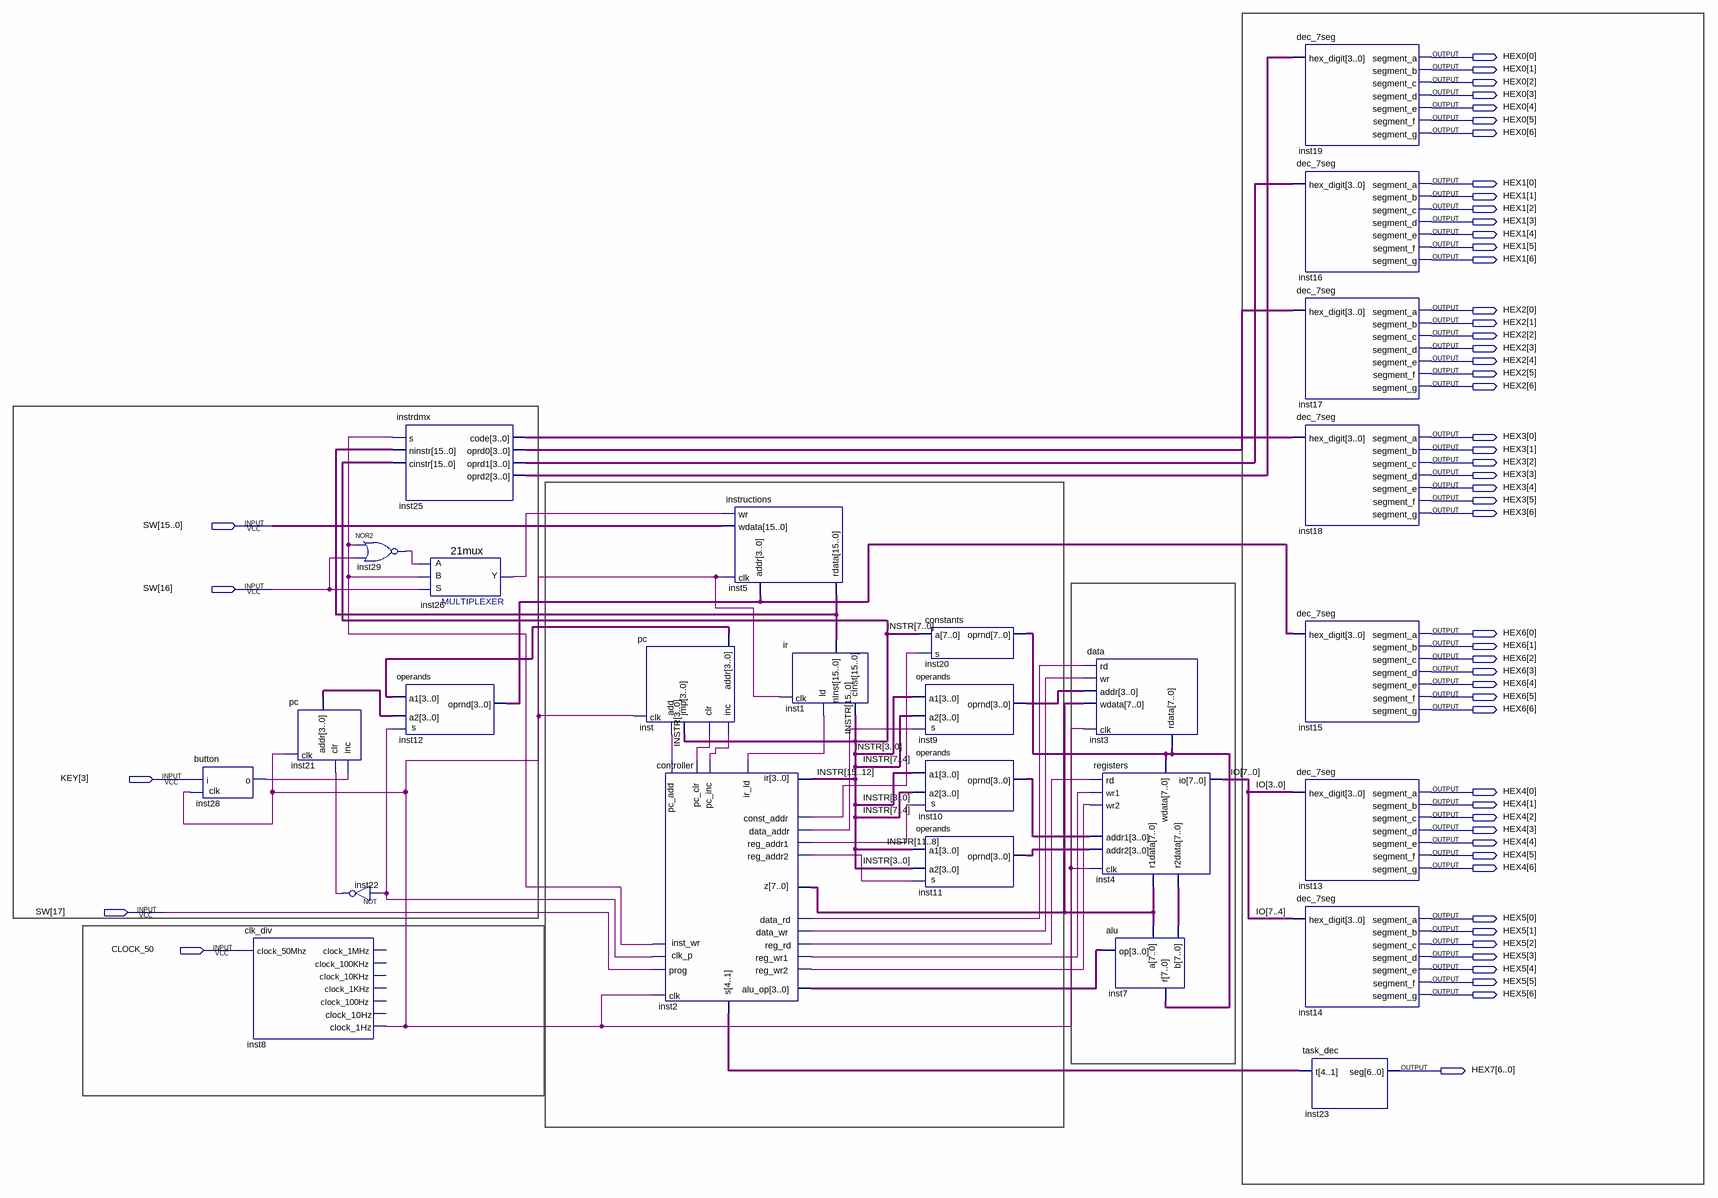
[diagram p0: schematic sheet]
// Quartus schematic pprocessor.bdf as structural Verilog: 27 symbols, 55 pins
module pprocessor (
  input  [17:0] SW,
  input  [3:3] KEY,
  input  CLOCK_50,
  output [6:0] HEX0,
  output [6:0] HEX1,
  output [6:0] HEX2,
  output [6:0] HEX3,
  output [6:0] HEX6,
  output [6:0] HEX4,
  output [6:0] HEX5,
  output [6:0] HEX7
);

  wire inst2_clk_p, inst2_const_addr, inst2_data_addr, inst2_data_rd, inst2_data_wr, inst2_inst_wr,
       inst2_ir_ld, inst2_pc_add, inst2_pc_clr, inst2_pc_inc, inst2_reg_addr1, inst2_reg_addr2, inst2_reg_rd,
       inst2_reg_wr1, inst2_reg_wr2, inst8_clock_1hz, inst22_out, inst26_y, inst28_o, inst29_out;
  wire [3:0] inst2_alu_op, inst2_s, inst9_oprnd, inst10_oprnd, inst11_oprnd, inst12_oprnd, inst21_addr,
       inst25_code, inst25_oprd0, inst25_oprd1, inst25_oprd2, inst_addr;
  wire [7:0] inst4_r1data, inst4_r2data, inst20_oprnd, IO;
  wire [15:0] inst5_rdata, INSTR;

  button inst28 (.clk(inst8_clock_1hz), .i(KEY[3]), .o(inst28_o));
  clk_div inst8 (
    .clock_50Mhz(CLOCK_50), .clock_1Hz(inst8_clock_1hz));  // open: clock_1MHz, clock_100KHz, clock_10KHz, clock_1KHz, clock_100Hz, clock_10Hz
  pc inst21 (.clk(inst8_clock_1hz), .inc(inst28_o), .clr(inst22_out), .addr(inst21_addr));
  nor inst29 (inst29_out, inst2_inst_wr, SW[16]);
  not inst22 (inst22_out, inst2_clk_p);
  instrdmx inst25 (
    .s(inst2_inst_wr), .ninstr(inst5_rdata), .cinstr(INSTR), .code(inst25_code), .oprd0(inst25_oprd0),
    .oprd1(inst25_oprd1), .oprd2(inst25_oprd2));
  \21mux  inst26 (.S(SW[16]), .B(inst2_inst_wr), .A(inst29_out), .Y(inst26_y));
  operands inst12 (.s(inst2_clk_p), .a1(inst_addr), .a2(inst21_addr), .oprnd(inst12_oprnd));
  pc inst (
    .clk(inst8_clock_1hz), .inc(inst2_pc_inc), .clr(inst2_pc_clr), .add(inst2_pc_add), .jmp(INSTR[3:0]),
    .addr(inst_addr));
  controller inst2 (
    .z(inst4_r1data), .ir(INSTR[15:12]), .prog(SW[17]), .clk(inst8_clock_1hz), .pc_clr(inst2_pc_clr),
    .pc_inc(inst2_pc_inc), .ir_ld(inst2_ir_ld), .data_rd(inst2_data_rd), .data_wr(inst2_data_wr),
    .reg_rd(inst2_reg_rd), .reg_wr1(inst2_reg_wr1), .reg_wr2(inst2_reg_wr2), .inst_wr(inst2_inst_wr),
    .clk_p(inst2_clk_p), .data_addr(inst2_data_addr), .reg_addr1(inst2_reg_addr1),
    .reg_addr2(inst2_reg_addr2), .const_addr(inst2_const_addr), .pc_add(inst2_pc_add), .alu_op(inst2_alu_op),
    .s(inst2_s));
  instructions inst5 (.clk(inst8_clock_1hz), .wr(inst26_y), .addr(inst12_oprnd), .wdata(SW[15:0]), .rdata(inst5_rdata));
  ir inst1 (.clk(inst8_clock_1hz), .ld(inst2_ir_ld), .nInst(inst5_rdata), .cInst(INSTR));
  constants inst20 (.s(inst2_const_addr), .a(INSTR[7:0]), .oprnd(inst20_oprnd));
  operands inst9 (.s(inst2_data_addr), .a1(INSTR[3:0]), .a2(INSTR[7:4]), .oprnd(inst9_oprnd));
  operands inst10 (.s(inst2_reg_addr1), .a1(INSTR[3:0]), .a2(INSTR[7:4]), .oprnd(inst10_oprnd));
  operands inst11 (.s(inst2_reg_addr2), .a1(INSTR[11:8]), .a2(INSTR[3:0]), .oprnd(inst11_oprnd));
  data inst3 (
    .clk(inst8_clock_1hz), .rd(inst2_data_rd), .wr(inst2_data_wr), .addr(inst9_oprnd), .wdata(inst4_r1data),
    .rdata(inst20_oprnd));
  registers inst4 (
    .clk(inst8_clock_1hz), .rd(inst2_reg_rd), .wr1(inst2_reg_wr1), .wr2(inst2_reg_wr2), .addr1(inst10_oprnd),
    .addr2(inst11_oprnd), .wdata(inst20_oprnd), .r1data(inst4_r1data), .r2data(inst4_r2data), .io(IO));
  alu inst7 (.op(inst2_alu_op), .a(inst4_r1data), .b(inst4_r2data), .r(inst20_oprnd));
  dec_7seg inst19 (
    .hex_digit(inst25_oprd2), .segment_a(HEX0[0]), .segment_b(HEX0[1]), .segment_c(HEX0[2]),
    .segment_d(HEX0[3]), .segment_e(HEX0[4]), .segment_f(HEX0[5]), .segment_g(HEX0[6]));
  dec_7seg inst16 (
    .hex_digit(inst25_oprd1), .segment_a(HEX1[0]), .segment_b(HEX1[1]), .segment_c(HEX1[2]),
    .segment_d(HEX1[3]), .segment_e(HEX1[4]), .segment_f(HEX1[5]), .segment_g(HEX1[6]));
  dec_7seg inst17 (
    .hex_digit(inst25_oprd0), .segment_a(HEX2[0]), .segment_b(HEX2[1]), .segment_c(HEX2[2]),
    .segment_d(HEX2[3]), .segment_e(HEX2[4]), .segment_f(HEX2[5]), .segment_g(HEX2[6]));
  dec_7seg inst18 (
    .hex_digit(inst25_code), .segment_a(HEX3[0]), .segment_b(HEX3[1]), .segment_c(HEX3[2]),
    .segment_d(HEX3[3]), .segment_e(HEX3[4]), .segment_f(HEX3[5]), .segment_g(HEX3[6]));
  dec_7seg inst15 (
    .hex_digit(inst12_oprnd), .segment_a(HEX6[0]), .segment_b(HEX6[1]), .segment_c(HEX6[2]),
    .segment_d(HEX6[3]), .segment_e(HEX6[4]), .segment_f(HEX6[5]), .segment_g(HEX6[6]));
  dec_7seg inst13 (
    .hex_digit(IO[3:0]), .segment_a(HEX4[0]), .segment_b(HEX4[1]), .segment_c(HEX4[2]), .segment_d(HEX4[3]),
    .segment_e(HEX4[4]), .segment_f(HEX4[5]), .segment_g(HEX4[6]));
  dec_7seg inst14 (
    .hex_digit(IO[7:4]), .segment_a(HEX5[0]), .segment_b(HEX5[1]), .segment_c(HEX5[2]), .segment_d(HEX5[3]),
    .segment_e(HEX5[4]), .segment_f(HEX5[5]), .segment_g(HEX5[6]));
  task_dec inst23 (.t(inst2_s), .seg(HEX7));
endmodule
